# Altium schematic sheet OLED&OPENMV.SchDoc
size A4
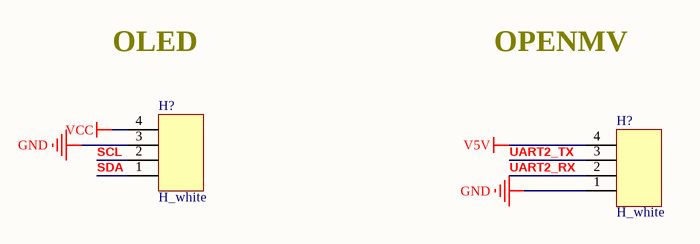
[diagram p0: OLED&OPENMV.SchDoc]

## Parts
(Parts that share a designator on the sheet are numbered #1, #2 ... from top to bottom, then left to right.)
H?#1  H_white  [H4_white]
H?#2  H_white  [H4_white]

## Nets
GND: H?#1.3 H?#2.1
V5V: H?#2.4
VCC: H?#1.4
SCL: H?#1.2
SDA: H?#1.1
UART2_RX: H?#2.2
UART2_TX: H?#2.3

## Notes on the sheet
- OLED
- OPENMV

## Library data of the parts
H?#1 H?#2 = header4 white